# Altium schematic sheet Sheet1.SchDoc
size A
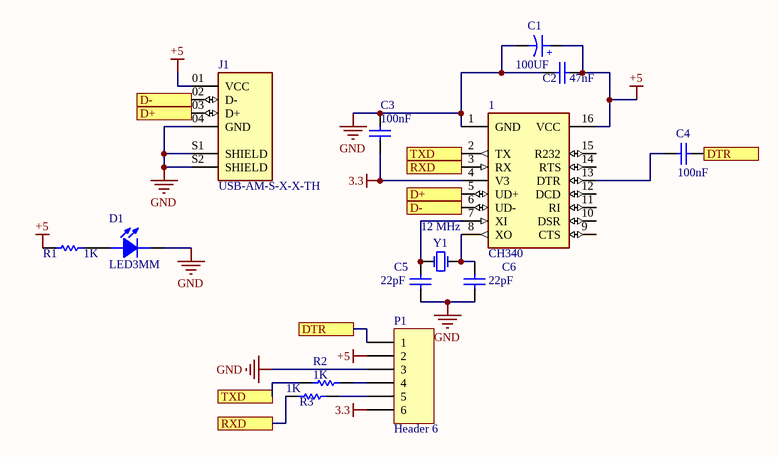
[diagram p0: Sheet1.SchDoc]

## Parts
1  CH340  [SOIC16]
C1  100UF  [Cap electrolitic radial 5x12-2]
C2  47nF  [Cap-100nF]
C3  100nF  [Cap-100nF]
C4  100nF  [Cap-100nF]
C5  22pF  [Cap-100nF]
C6  22pF  [Cap-100nF]
D1  LED3MM  [LED3mm_GRN]
J1  USB-AM-S-X-X-TH  [SAMTEC_USB-AM-S-X-X-TH]
P1  Header 6  [HDR1X6]
R1  1K  [RES-(1/4)]
R2  1K  [RES-(1/4)]
R3  1K  [RES-(1/4)]
Y1  12 MHz  [XTAL 16MHZ]

## Ports
D+, D-, DTR, RXD, TXD

## Nets
3.3: 1.4(V3) C3.1 P1.6
+5: 1.16(VCC) C1.1 C2.1 J1.01(VCC) P1.2 R1.1
GND: 1.1(GND) C1.2 C2.2 C3.2 C5.1 C6.1 D1.2(CATHODE) J1.04(GND) J1.S1(SHIELD) J1.S2(SHIELD) P1.3
D+: 1.5(UD+) J1.03(D+) ; port D+
D-: 1.6(UD-) J1.02(D-) ; port D-
DTR: C4.1 P1.1 ; port DTR
RXD: 1.3(RX) R2.1 ; port RXD
TXD: 1.2(TX) R3.1 ; port TXD
Net1_7: 1.7(XI) C5.2 Y1.1(OSC1)
Net1_8: 1.8(XO) C6.2 Y1.2(OSC2)
Net1_13: 1.13(DTR) C4.2
NetD1_1: D1.1(ANODE) R1.2
NetP1_4: P1.4 R3.2
NetP1_5: P1.5 R2.2

Not connected (* = marked no-connect by the designer): 1 9(CTS) 10(DSR) 11(RI) 12(DCD) 14(RTS) 15(R232)

## Notes on the sheet
- (in symbol Cap ELECTROLITIC TOTAL SIZE) +

## Library data of the parts
1 = CH340: Circuit Breaker Magnetic 3Pole 40A 240VAC; MF: Eaton; Availability: Unavailable; Price: None; Package: None; Value: *; SnapEDA_Link: https://www.snapeda.com/parts/CH340/Eaton/view-part/4701946/?ref=snap; MP: CH340
C1 = Cap ELECTROLITIC TOTAL SIZE: Cap electrolitic radial; Designer: Abbas Basereh; VALUE: 1uF; Data: 16-12-2016; Part. No: *
C2-C6 = CAP CERAMIC TOTAL SIZE: CAP Ceramic Total; Designer: Ali Hafizi
D1 = LED 3MM: Light Emitting Diode; Designer: Ali Hafizi
J1 = USB-AM-S-X-X-TH: USB-A (USB TYPE-A) USB 2.0 Plug Connector 4 Position Through Hole, Right Angle; MF: Samtec; MP: USB-AM-S-F-B-TH; Toby_UK-Purchase-URL: https://snapeda.com/shop?store=Toby+UK&id=474273; Price: None; SnapEDA_Link: https://www.snapeda.com/parts/USB-AM-S-F-B-TH/Samtec%20Inc./view-part/474273/?ref=snap; Availability: Unavailable; Package: None; Value: *
P1 = Header 6: Header, 6-Pin; LatestRevisionDate: 17-Jul-2002; LatestRevisionNote: Re-released for DXP Platform.; Publisher: Altium Limited
R1-R3 = RES DIP PACKAGE: TOTAL DIP RESISTOR PACK; Designer: Ali Hafizi
Y1 = XTAL: XTAL Crystal; Designer: ABBAS BASEREH; Design Date: 2017-1-3; ComponentLink1Description: Datasheet; ComponentLink2Description: Reference; Mounting Technology: Surface Mount\Through-Hole; Value: 12 MHz; Status: Unreleased